# EAGLE design BackscatterPlantSensor_v6_1tsoic (EAGLE 6.4)

## Sheet 1 of 4
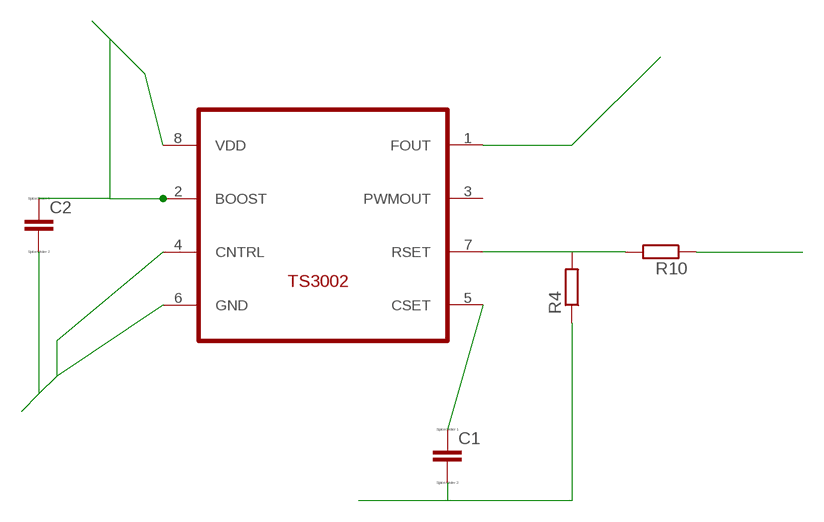
[diagram p0: schematic, sheet 1]

### Parts
C1  CC0603  [C0603]
C2  CC0603  [C0603]
R4  R-EU_R0603  [R0603]
R10  R-EU_R0603  [R0603]
U$1  TS3002  [TDFN22-8]

### Nets
DGND: C1.2 C2.2 R4.1 U$1.4(CNTRL) U$1.6(GND) ; also sheet 2
FOUT: U$1.1(FOUT) ; also sheet 2
N$1: C1.1 U$1.5(CSET)
N$2: R4.2 R10.2 U$1.7(RSET)
VCOND: R10.1 ; also sheet 4
VDD: C2.1 U$1.2(BOOST) U$1.8(VDD) ; also sheet 3,4
Unconnected: U$1.3(PWMOUT)

## Sheet 2 of 4
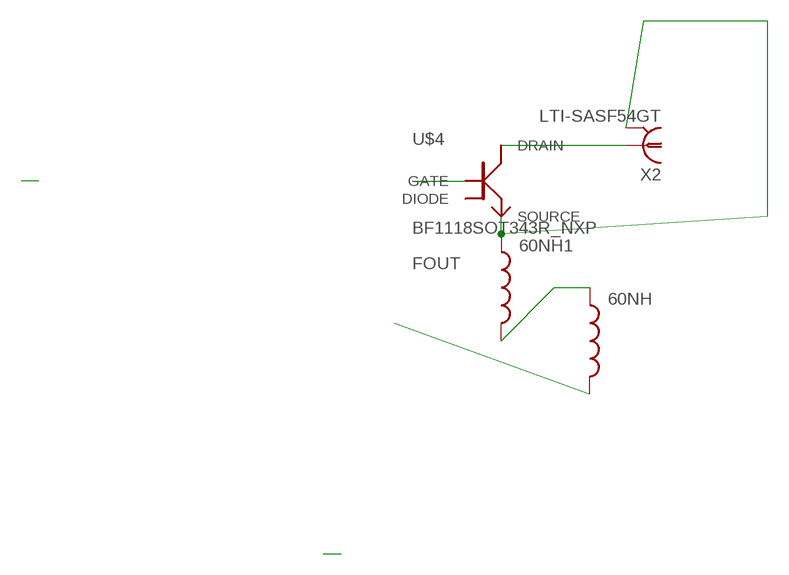
[diagram p1: schematic, sheet 2]

### Parts
60NH  INDUCTOR0402  [C0402]
60NH1  INDUCTOR0402  [C0402]
U$4  BF1118SOT343R_NXP  [SOT343R]
X2  LTI-SASF54GT  [LTI-SASF54GT]

### Nets
DGND: U$4.1(GATE) ; also sheet 1
DRAIN: U$4.4(DRAIN) X2.1
FOUT: 60NH.2 ; also sheet 1
FOUT2: 60NH1.1 U$4.3(SOURCE) X2.2(GND)
N$3: 60NH1.2 60NH.1
Unconnected: U$4.2(DIODE)

## Sheet 3 of 4
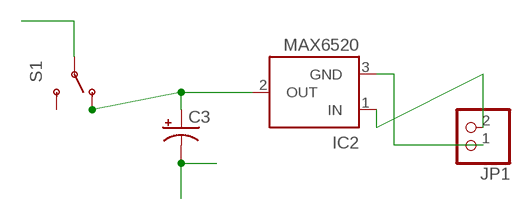
[diagram p2: schematic, sheet 3]

### Parts
C3  CAP_POL1206  [EIA3216]
IC2  MAX6520  [SOT23]
JP1  PINHD-1X2  [1X02]
S1  SWITCH-SPDTPTH  [SWITCH-SPDT]

### Nets
GND: C3.C(-) IC2.3(GND) JP1.1
N$4: IC2.1(IN) JP1.2
N$7: C3.A(+) IC2.2(OUT) S1.1(O)
VDD: S1.2(P) ; also sheet 1,4
Unconnected: S1.3(S)

## Sheet 4 of 4
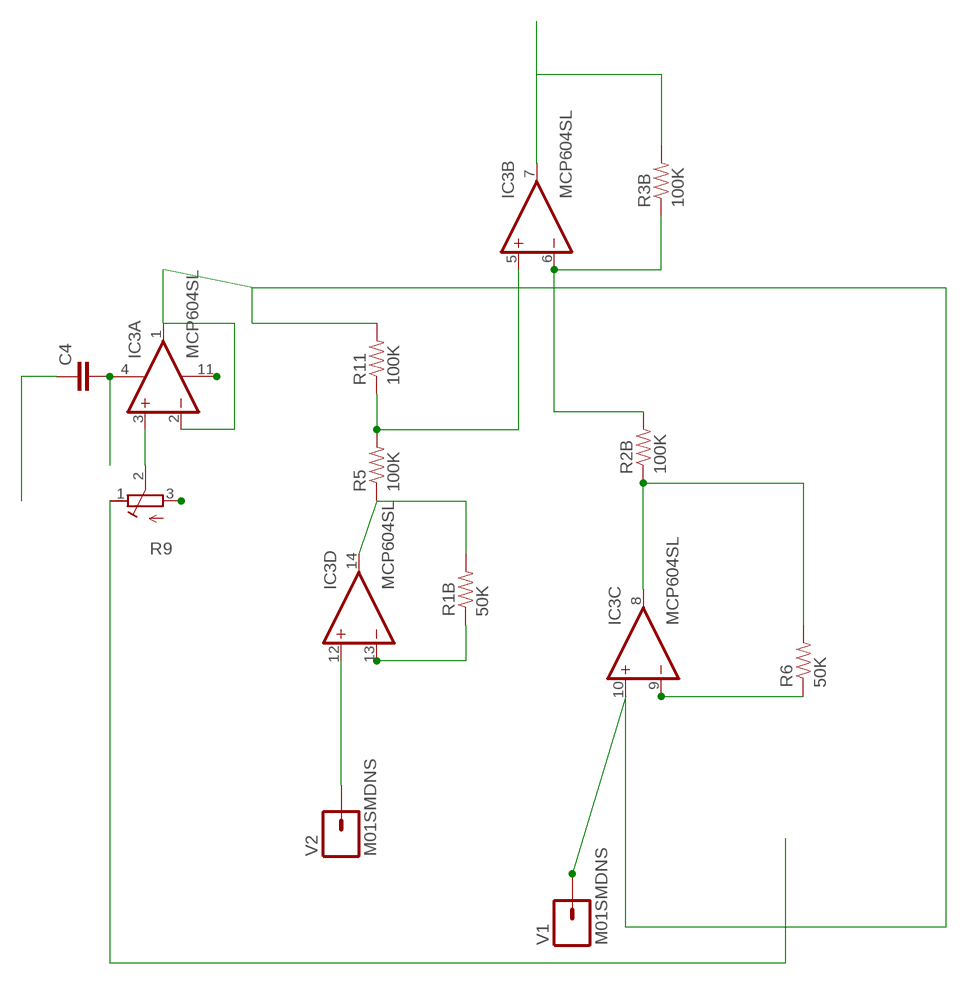
[diagram p3: schematic, sheet 4]

### Parts
C4  CAP0603-CAP  [0603-CAP]
IC3  MCP604SL  [SO14]
R1B  50K  RESISTOR  [0805]
R2B  100K  RESISTOR  [0805]
R3B  100K  RESISTOR  [0805]
R5  100K  RESISTOR  [0805]
R6  50K  RESISTOR  [0805]
R9  R-TRIMM3314G  [RTRIM3314G]
R11  100K  RESISTOR  [0805]
V1  M01SMDNS  [1X01NS]
V2  M01SMDNS  [1X01NS]

### Nets
AGND: C4.1 IC3.11(P:V-) R9.3(A)
N$10: IC3.9(C:-IN) R6.1
N$23: IC3.8(C:OUT) R2B.1 R6.2
N$49: IC3.14(D:OUT) R1B.2 R5.1
N$58: IC3.6(B:-IN) R2B.2 R3B.1
N$99: IC3.12(D:+IN) V2.1
N$105: IC3.3(A:+IN) R9.2(S)
N$107: IC3.13(D:-IN) R1B.1
N$118: IC3.5(B:+IN) R5.2 R11.1
VCOND: IC3.7(B:OUT) R3B.2 ; also sheet 1
VDD: C4.2 IC3.4(P:V+) R9.1(E) ; also sheet 1,3
VRF1: IC3.1(A:OUT) IC3.2(A:-IN) IC3.10(C:+IN) R11.2 V1.1

## Power pins joined to a net without a drawn wire
GND: X2.3(GND) X2.4(GND) X2.5(GND)

## Library data of the parts
60NH 60NH1 = SparkFun:INDUCTOR: Inductors Basic Inductor/Choke - 0603 and 1206. Footprints are not proven and vary greatly between part numbers.
C1 C2 = eagle-ltspice:C: CAPACITOR, European symbol; SPICEMODEL: NONE; SPICEPREFIX: C
C3 = SparkFun-Capacitors:CAP_POL: Capacitor Polarized These are standard SMD and PTH capacitors. Normally 10uF, 47uF, and 100uF in electrolytic and tantalum varieties. Always verify the external diameter of the through hole cap, it varies with capacity, voltage, and manufacturer. The EIA devices should be standard.
C4 = SparkFun-Passives:CAP: Capacitor Standard 0603 ceramic capacitor, and 0.1" leaded capacitor.
IC2 = maxim:MAX6520: 1.2V Voltage Reference 50ppm/°C, SOT23, 3-Terminal Source: Data sheet <http://datasheets.maxim-ic.com/en/ds/MAX6520.pdf>; MF: MAXIM; MPN: MAX6520EUR-T; OC_FARNELL: unknown; OC_NEWARK: 02J4586
IC3 = linear:MCP604: Quad Op Amp 2.7V to 6.0V Single Supply CMOS Source: http://ww1.microchip.com/downloads/en/DeviceDoc/21314g.pdf
JP1 = pinhead:PINHD-1X2: PIN HEADER
R1B R2B R3B R5 R6 R11 = SparkFun:RESISTOR: Resistor Basic schematic elements and footprints for 0603, 1206, and PTH 1/10th watt (small) resistors.
R4 R10 = rcl:R-EU_: RESISTOR, European symbol
R9 = rcl:R-TRIMM: Trimm resistor
S1 = semipassiveTag_library:SWITCH-SPDT: SPST Switch Simple slide switch. Spark Fun Electronics SKU : COM-00102
U$1 = ts3002TDFN22_8pin:TS3002
U$4 = rf_transistors:BF1118
V1 V2 = SparkFun-Connectors:M01: Header 1 Standard 1-pin 0.1" header. Use with straight break away headers (SKU : PRT-00116), right angle break away headers (PRT-00553), swiss pins (PRT-00743), machine pins (PRT-00117), and female headers (PRT-00115).
X2 = con-coax:LTI-SASF54GT: SMA vertical PCB thrue hole jack Source: Lighthorse Technologies, inc. SASF54GT.pdf; OC_FARNELL: unknown; OC_NEWARK: unknown

## Board
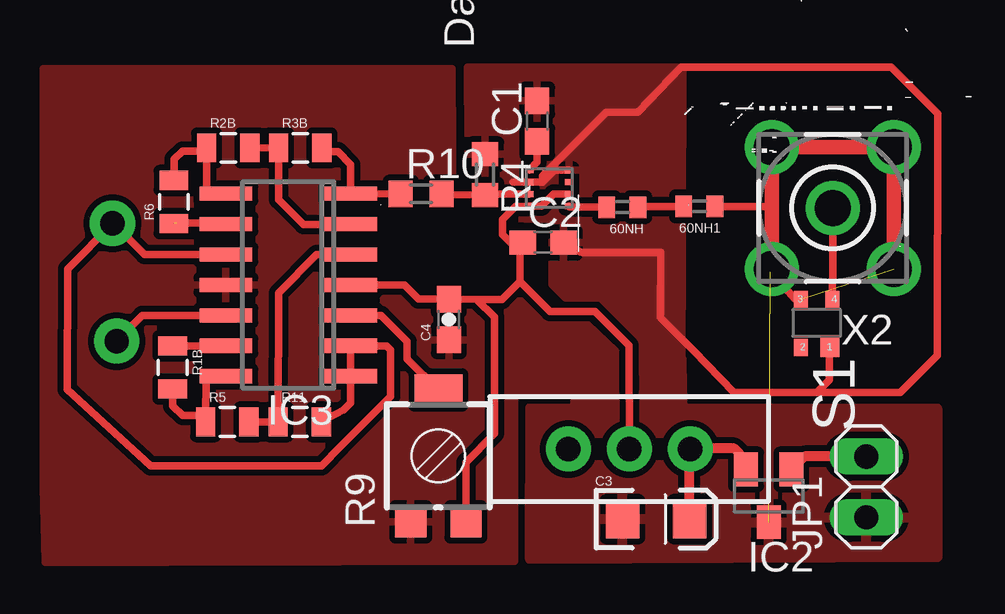
[diagram p4: board, top side]

No outline drawn. Coordinates in mm, seen from the top.
Copper layers (1*16): Top 0.035mm / dielectric 1.5mm / Bottom 0.035mm
Design rules "default *": minimum track width 10mil, minimum drill 24mil, track to track 10mil, track to pad 10mil, pad to pad 10mil, via to via 10mil, smd to smd 10mil, copper to edge 40mil, drill to drill 8mil, minimum pad ring 10mil, minimum via ring 8mil, stop-mask expansion 4mil, vias tented up to drill 0mil, thermal gap 10mil

### Footprints (pad centres in the part's own frame; a part is rotated, then mirrored left to right if it is on the bottom)
C0402 = smd 0.7 x 0.9: 1 -0.65,0; 2 0.65,0
C0603 = smd 1.1 x 1: 1 -0.85,0; 2 0.85,0
EIA3216 = smd 1.4 x 1.6: A 1.4,0; C -1.4,0
0603-CAP = smd 1.1 x 1: 1 -0.85,0; 2 0.85,0
SOT23 = smd 1 x 1.4: 1 -0.95,-1.1; 2 0.95,-1.1; 3 0,1.1
SO14 = smd 0.6 x 2.2: 1 -3.81,-2.6; 2 -2.54,-2.6; 3 -1.27,-2.6; 4 0,-2.6; 5 1.27,-2.6; 6 2.54,-2.6; 7 3.81,-2.6; 8 3.81,2.6; 9 2.54,2.6; 10 1.27,2.6; 11 0,2.6; 12 -1.27,2.6; 13 -2.54,2.6; 14 -3.81,2.6
1X02 = drill 1.016 long: 1 -1.27,0; 2 1.27,0
0805 = smd 0.8 x 1.2: 1 -0.9,0; 2 0.9,0
R0603 = smd 1 x 1.1: 1 -0.85,0; 2 0.85,0
RTRIM3314G = smd 1.3 x 1.3: 1 1.15,-2.75; 3 -1.15,-2.75 | smd 2 x 1.3: 2 0,2.75
SWITCH-SPDT = drill 1.016 pad 1.88: 1 0,2.54; 2 0,0; 3 0,-2.54
TDFN22-8 = smd 0.35 x 0.25: 1 -1.78,-0.7; 2 -1.78,-1.2; 3 -1.78,-1.7; 4 -1.78,-2.2; 5 -0.13,-2.2; 6 -0.13,-1.7; 7 -0.13,-1.2; 8 -0.13,-0.7
SOT343R = smd 0.8 x 0.8: 1 0.55,-1.07 | smd 0.6 x 0.7: 2 -0.66,-1.07; 3 -0.66,0.94; 4 0.65,0.94
1X01NS = drill 1.016 pad 1.88: 1 0,0
LTI-SASF54GT = drill 1.5 pad 2.2: 1 0,0; 2 -2.54,2.54; 3 2.54,2.54; 4 2.54,-2.54; 5 -2.54,-2.54

### Placement (x,y rotation side)
60NH  76.47,63.72 180 top
60NH1  79.68,63.75 180 top
C1  72.92,67.3 90 top
C2  73.17,62.24 0 top
C3  77.88,50.71 0 top
C4  69.24,59.03 90 top
IC2  82.57,51.68 180 top
IC3  62.54,60.47 90 top
JP1  86.64,52.05 90 top
R1B  57.73,57.03 270 top
R2B  60.04,66.19 0 top
R3B  63.04,66.19 0 top
R4  70.74,65.08 270 top
R5  60,54.76 0 top
R6  57.78,63.93 90 top
R9  68.8,53.35 0 top
R10  68.08,64.27 0 top
R11  63.02,54.76 0 top
S1  76.76,53.63 270 top
U$1  72.46,63.06 180 top
U$4  84.57,58.94 0 top
V1  55.21,63.04 0 top
V2  55.39,58.13 0 top
X2  85.24,63.69 180 top

### Tracks (layer width: path | path; a pad name or v marks a point on that pad's centre or on a via)
AGND
  pour Top: 71.98,56.07 76.21,56.03 76.18,57.72 75,58.85 73.59,58.87 72.08,60.38 72.08,63 71.95,63.13 69.41,63.13 69.36,69.5 52.33,69.49 52.33,52.08 52.41,48.91 57.51,48.9 71.98,48.94
DGND
  Top 0.305: 73.13,64.77 U$1.6 71.91,64.76 | 73.13,64.77 73.63,65.26 U$1.4 | 74.72,61.84 C2.2 74.81,61.82 78.08,61.82 78.06,59.12 79.43,57.73 81.12,55.98 84.58,55.99 | U$4.1 85.09,57.42 85.09,56.51 84.58,55.99 | 73.13,64.77 73.13,65 75.81,67.68 77.12,67.68 78.91,69.55 87.68,69.55 89.61,67.62 89.59,57.53 88.05,55.99 86.37,56 84.58,55.99
  pour Top: 70.01,69.55 70.05,63.27 73.53,63.2 73.53,60.48 74.09,59.92 75.55,59.92 77.23,58.26 77.35,56.19 78.95,56.08 79,69.56
DRAIN
  Top 0.305: U$4.4 85.24,61.3 X2.1
FOUT
  Top 0.305: 60NH.2 74.29,63.72 U$1.1
FOUT2  (1 unrouted)
  Top 0.305: 87.76,66.16 87.75,66.05 | U$4.3 83.66,59.88 82.7,61 82.69,61.47 82.64,61.52 82.64,63.65 82.63,63.66 | 82.75,63.78 82.63,63.66 | 82.63,63.66 82.63,63.7 | 82.63,63.7 82.64,63.71 | 60NH1.1 82.58,63.75 82.63,63.7
  Top 0.61: 87.75,66.05 87.78,66.1 X2.2
GND  (1 unrouted)
  Top 0.305: X2.3 82.64,61.03 82.65,61.02 82.61,61.02 82.59,61.04 82.59,61.16 82.58,61.17
  Top 0.61: X2.3 X2.4 X2.5
  pour Top: 72.63,55.35 89.59,55.33 89.6,49.12 72.62,49.03
N$1
  Top 0.305: U$1.5 72.92,65.59 C1.1
N$2
  Top 0.305: R10.2 69.04,64.23 R4.2 71.11,64.26 U$1.7
N$3
  Top 0.305: 60NH1.2 77.14,63.74 60NH.1
N$4
  Top 0.406: JP1.2 84.06,53.32 IC2.1
N$7
  Top 0.406: C3.A 79.25,53.6 S1.1 79.12,53.65 81.13,53.65 81.62,53.16 IC2.2
N$10  (1 unrouted)
  Top 0.305: IC3.9 59.89,63.06 57.88,63.06
N$14
  pour Top: 76.66,56.83 76.69,54.94 74.45,54.85 74.45,56.83
N$21
  pour Top: 77.3,54.81 77.32,57.35 79,57.38 79.03,54.95 78.19,54.8 77.92,54.8
N$23
  Top 0.254: R2B.1 59.1,66.2
  Top 0.305: R6.2 57.79,65.73 58.13,66.06 58.92,66.06 R2B.1 59.13,64.51 59.34,64.3 59.92,64.3 IC3.8
N$49
  Top 0.305: R1B.2 57.73,55.42 58.13,55.03 58.82,55.03 R5.1 59.11,56.74 59.86,56.74 IC3.14
N$58
  Top 0.305: IC3.6 63.19,63 62.15,64.04 R3B.1 62.17,66.18 R2B.2
N$99
  Top 0.305: V2.1 56.46,59.2 IC3.12
N$105
  Top 0.305: R9.2 67.5,57.38 67.5,58.11 66.41,59.2 IC3.3
N$107
  Top 0.305: IC3.13 R1B.1
N$118
  Top 0.305: R11.1 62.14,60.14 63.73,61.74 IC3.5 | R5.2 R11.1 | 62.17,54.76 R11.1
VCOND
  Top 0.305: R10.1 67.13,64.27 IC3.7 65.15,65.5 64.61,66.04 63.95,66.04 R3B.2
VDD
  Top 0.305: U$1.2 73.6,64.26 73.1,63.76 U$1.8 72.02,63.75 71.48,63.19 71.47,63.18 71.47,62.57 71.8,62.24 C2.1 72.2,62.12 72.2,60.62 | S1.2 76.75,57.94 75.33,59.37 73.46,59.36 72.2,60.62 | IC3.4 67.38,60.47 67.97,59.88 C4.2 70.39,59.86 | R9.1 69.96,53.08 71.14,54.29 71.13,59.13 70.39,59.86 | 70.39,59.86 71.45,59.86 72.2,60.62
VRF1
  Top 0.305: V1.1 55.25,63.05 | 55.25,63.05 56.56,61.74 56.61,61.73 IC3.10 | R11.2 64.84,55.27 65.13,55.56 IC3.1 IC3.2 66.64,57.93 66.81,57.76 66.81,55.82 64.73,53.74 63.93,52.93 56.81,52.93 53.33,56.11 53.34,61.13 55.25,63.05

### Text on the board
tPlace: Daskals